# EAGLE design Cardbus Card Extender (EAGLE 6.5.0)
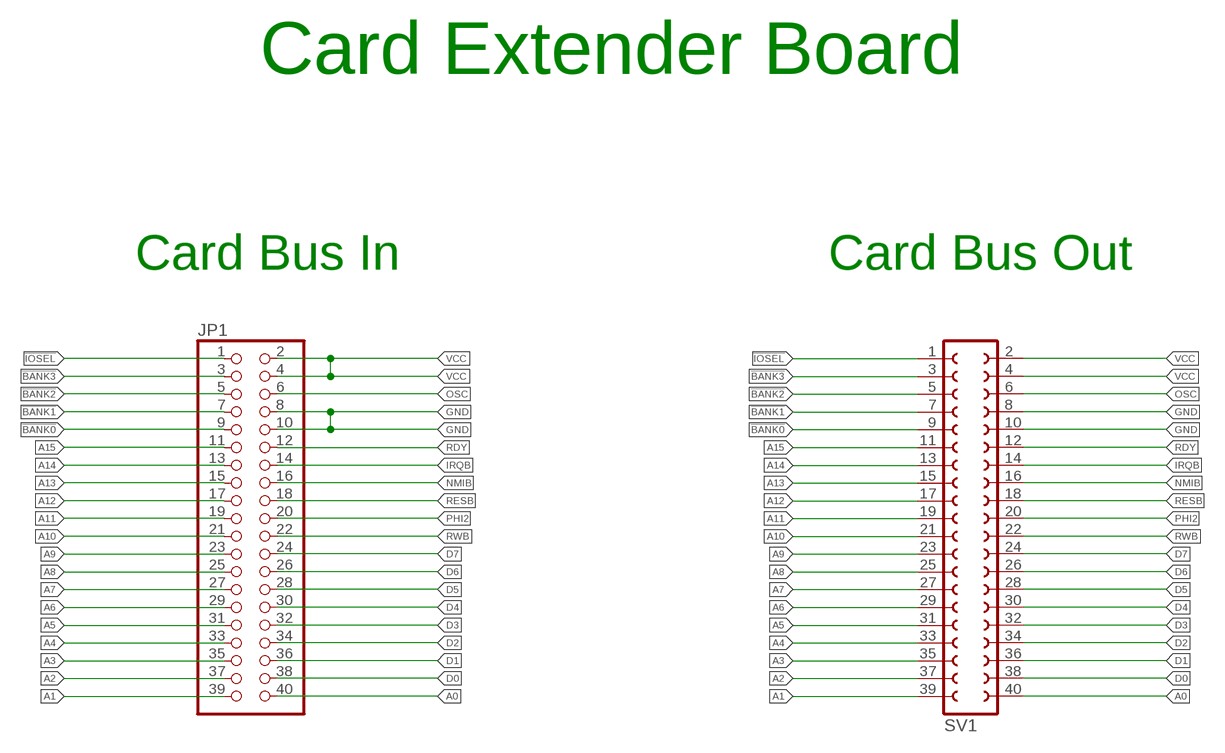
[diagram p0: schematic, sheet 1]

## Parts
JP1  PINHD-2X20/90  [2X20/90]
SV1  FE20-2W  [FE20-2W]

## Nets
!BANK0: JP1.9 SV1.9
!BANK1: JP1.7 SV1.7
!BANK2: JP1.5 SV1.5
!BANK3: JP1.3 SV1.3
!IOSEL: JP1.1 SV1.1
A0: JP1.40 SV1.40
A1: JP1.39 SV1.39
A2: JP1.37 SV1.37
A3: JP1.35 SV1.35
A4: JP1.33 SV1.33
A5: JP1.31 SV1.31
A6: JP1.29 SV1.29
A7: JP1.27 SV1.27
A8: JP1.25 SV1.25
A9: JP1.23 SV1.23
A10: JP1.21 SV1.21
A11: JP1.19 SV1.19
A12: JP1.17 SV1.17
A13: JP1.15 SV1.15
A14: JP1.13 SV1.13
A15: JP1.11 SV1.11
D0: JP1.38 SV1.38
D1: JP1.36 SV1.36
D2: JP1.34 SV1.34
D3: JP1.32 SV1.32
D4: JP1.30 SV1.30
D5: JP1.28 SV1.28
D6: JP1.26 SV1.26
D7: JP1.24 SV1.24
GND: JP1.8 JP1.10 SV1.8 SV1.10
IRQB: JP1.14 SV1.14
NMIB: JP1.16 SV1.16
OSC: JP1.6 SV1.6
PHI2: JP1.20 SV1.20
RDY: JP1.12 SV1.12
RESB: JP1.18 SV1.18
RWB: JP1.22 SV1.22
VCC: JP1.2 JP1.4 SV1.2 SV1.4

## Notes on the sheet
- Card Extender Board
- Card Bus In | Card Bus Out

## Library data of the parts
JP1 = pinhead:PINHD-2X20: PIN HEADER
SV1 = con-lsta:FE20-2W: FEMALE HEADER; OC_FARNELL: unknown; OC_NEWARK: unknown

## Board
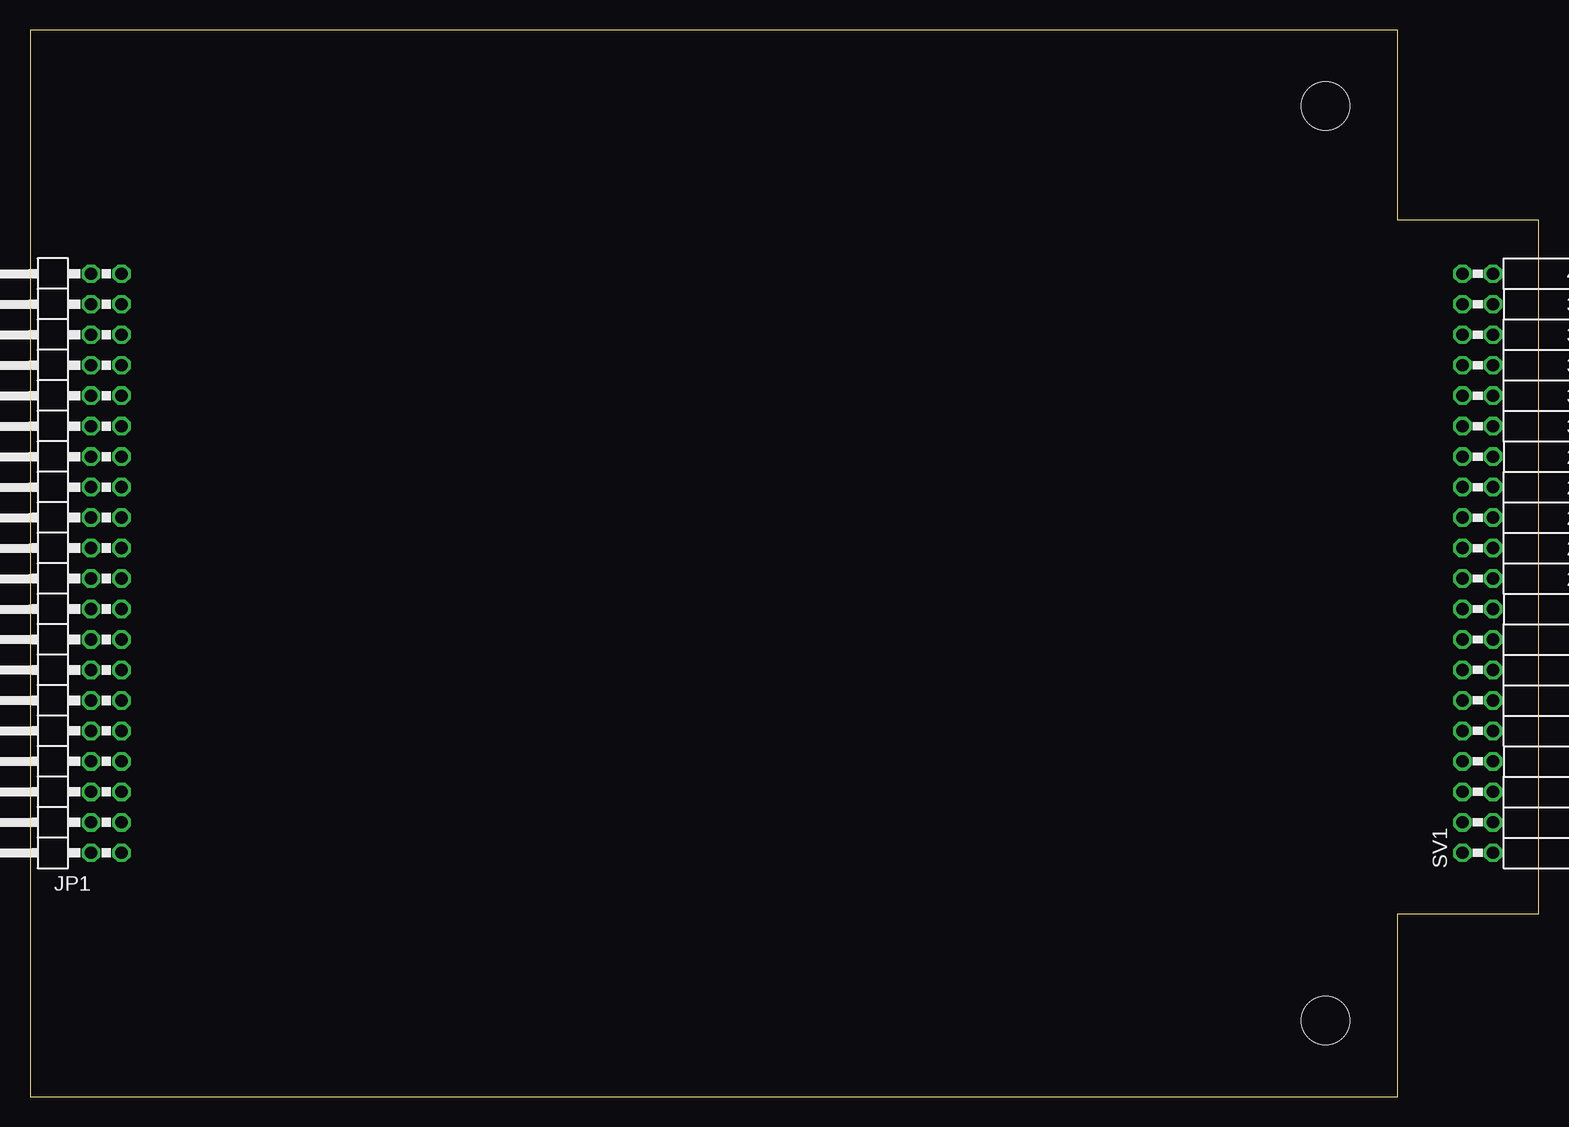
[diagram p1: board, top side]
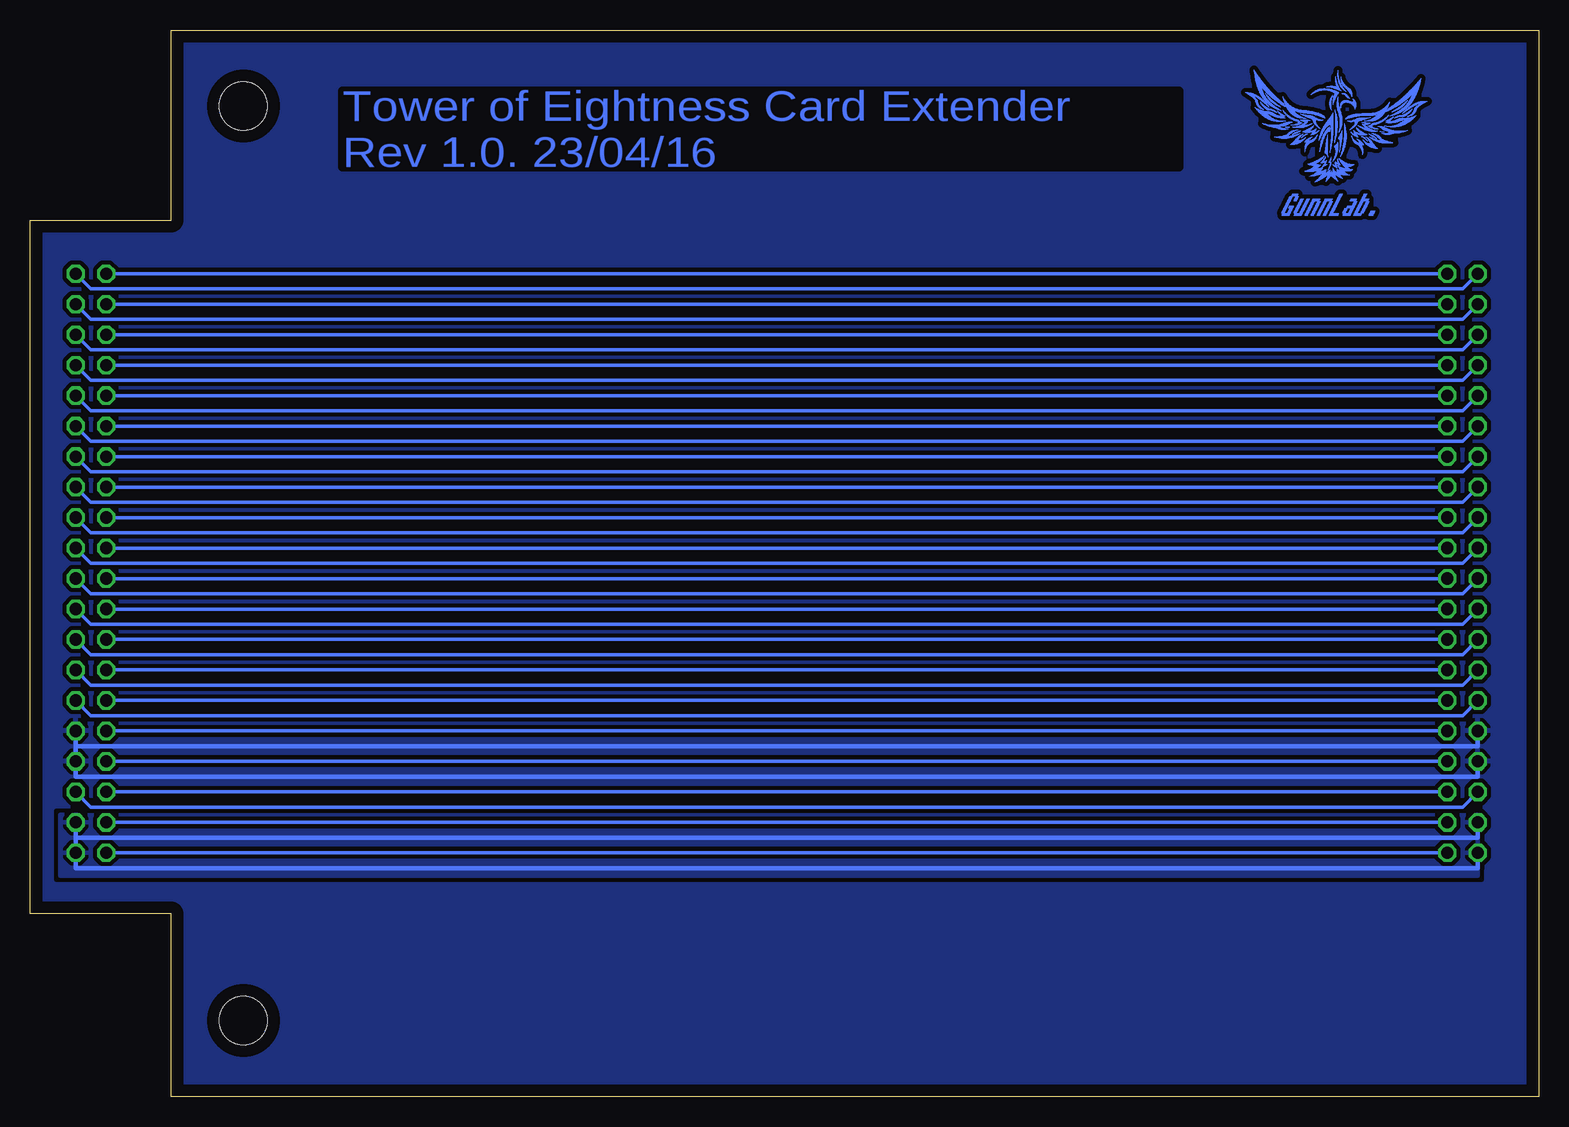
[diagram p2: board, bottom side, seen from below]

Size 125.73 x 88.89 mm. Coordinates in mm from the lower left corner, seen from the top.
Outline: 0,0 113.97,0 113.97,15.24 125.73,15.24 125.73,73.03 113.97,73.03 113.97,88.89 0,88.89 0,0
Copper layers (1*16): Top 0.035mm / dielectric 1.5mm / Bottom 0.035mm
Design rules "default *": minimum track width 10mil, minimum drill 24mil, track to track 8mil, track to pad 8mil, pad to pad 8mil, via to via 8mil, smd to smd 8mil, copper to edge 40mil, drill to drill 8mil, minimum pad ring 10mil, minimum via ring 8mil, stop-mask expansion 4mil, vias tented up to drill 0mil, thermal gap 12mil
Holes 4 mm at 107.95,82.55 107.95,6.35

### Footprints (pad centres in the part's own frame; a part is rotated, then mirrored left to right if it is on the bottom)
2X20/90 = drill 1.016 octagon: 1 -24.13,-6.35; 2 -24.13,-3.81; 3 -21.59,-6.35; 4 -21.59,-3.81; 5 -19.05,-6.35; 6 -19.05,-3.81; 7 -16.51,-6.35; 8 -16.51,-3.81; 9 -13.97,-6.35; 10 -13.97,-3.81; 11 -11.43,-6.35; 12 -11.43,-3.81; 13 -8.89,-6.35; 14 -8.89,-3.81; 15 -6.35,-6.35; 16 -6.35,-3.81; 17 -3.81,-6.35; 18 -3.81,-3.81; 19 -1.27,-6.35; 20 -1.27,-3.81; 21 1.27,-6.35; 22 1.27,-3.81; 23 3.81,-6.35; 24 3.81,-3.81; 25 6.35,-6.35; 26 6.35,-3.81; 27 8.89,-6.35; 28 8.89,-3.81; 29 11.43,-6.35; 30 11.43,-3.81; 31 13.97,-6.35; 32 13.97,-3.81; 33 16.51,-6.35; 34 16.51,-3.81; 35 19.05,-6.35; 36 19.05,-3.81; 37 21.59,-6.35; 38 21.59,-3.81; 39 24.13,-6.35; 40 24.13,-3.81
FE20-2W = drill 1.016 octagon: 1 -24.13,1.27; 2 -24.13,-1.27; 3 -21.59,1.27; 4 -21.59,-1.27; 5 -19.05,1.27; 6 -19.05,-1.27; 7 -16.51,1.27; 8 -16.51,-1.27; 9 -13.97,1.27; 10 -13.97,-1.27; 11 -11.43,1.27; 12 -11.43,-1.27; 13 -8.89,1.27; 14 -8.89,-1.27; 15 -6.35,1.27; 16 -6.35,-1.27; 17 -3.81,1.27; 18 -3.81,-1.27; 19 -1.27,1.27; 20 -1.27,-1.27; 21 1.27,1.27; 22 1.27,-1.27; 23 3.81,1.27; 24 3.81,-1.27; 25 6.35,1.27; 26 6.35,-1.27; 27 8.89,1.27; 28 8.89,-1.27; 29 11.43,1.27; 30 11.43,-1.27; 31 13.97,1.27; 32 13.97,-1.27; 33 16.51,1.27; 34 16.51,-1.27; 35 19.05,1.27; 36 19.05,-1.27; 37 21.59,1.27; 38 21.59,-1.27; 39 24.13,1.27; 40 24.13,-1.27

### Placement (x,y rotation side)
JP1  1.27,44.45 90 top
SV1  120.65,44.45 90 top
U$1  [LIONTECH]  17.14,80.01 0 top

### Tracks (layer width: path | path; a pad name or v marks a point on that pad's centre or on a via)
!BANK0
  Bottom 0.305: SV1.9 JP1.9
!BANK1
  Bottom 0.305: JP1.7 SV1.7
!BANK2
  Bottom 0.305: SV1.5 JP1.5
!BANK3
  Bottom 0.305: SV1.3 JP1.3
!IOSEL
  Bottom 0.305: JP1.1 SV1.1
A0
  Bottom 0.305: JP1.40 6.35,67.31 120.65,67.31 SV1.40
A1
  Bottom 0.305: JP1.39 SV1.39
A2
  Bottom 0.305: JP1.37 SV1.37
A3
  Bottom 0.305: JP1.35 SV1.35
A4
  Bottom 0.305: JP1.33 SV1.33
A5
  Bottom 0.305: JP1.31 SV1.31
A6
  Bottom 0.305: JP1.29 SV1.29
A7
  Bottom 0.305: JP1.27 SV1.27
A8
  Bottom 0.305: JP1.25 SV1.25
A9
  Bottom 0.305: SV1.23 JP1.23
A10
  Bottom 0.305: SV1.21 JP1.21
A11
  Bottom 0.305: SV1.19 JP1.19
A12
  Bottom 0.305: SV1.17 JP1.17
A13
  Bottom 0.305: SV1.15 JP1.15
A14
  Bottom 0.305: SV1.13 JP1.13
A15
  Bottom 0.305: SV1.11 JP1.11
D0
  Bottom 0.305: JP1.38 6.35,64.77 120.65,64.77 SV1.38
D1
  Bottom 0.305: JP1.36 6.35,62.23 120.65,62.23 SV1.36
D2
  Bottom 0.305: JP1.34 6.35,59.69 120.65,59.69 SV1.34
D3
  Bottom 0.305: JP1.32 6.35,57.15 120.65,57.15 SV1.32
D4
  Bottom 0.305: JP1.30 6.35,54.61 120.65,54.61 SV1.30
D5
  Bottom 0.305: JP1.28 6.35,52.07 120.65,52.07 SV1.28
D6
  Bottom 0.305: JP1.26 6.35,49.53 120.65,49.53 SV1.26
D7
  Bottom 0.305: JP1.24 6.35,46.99 120.65,46.99 SV1.24
GND
  Bottom 0.356: JP1.10 5.08,29.21 121.92,29.21 | 121.92,29.21 SV1.10 | JP1.8 5.08,26.67 121.92,26.67 SV1.8 121.92,29.21
  pour Bottom (isolate 0.356, rank 2): 0,88.9 114.3,88.9 114.3,73.03 125.73,73.03 125.73,15.24 114.3,15.24 114.3,0 0,0
IRQB
  Bottom 0.305: JP1.14 6.35,34.29 120.65,34.29 SV1.14
NMIB
  Bottom 0.305: JP1.16 6.35,36.83 120.65,36.83 SV1.16
OSC
  Bottom 0.305: JP1.6 6.35,24.13 120.65,24.13 SV1.6
PHI2
  Bottom 0.305: JP1.20 6.35,41.91 120.65,41.91 SV1.20
RDY
  Bottom 0.305: JP1.12 6.35,31.75 120.65,31.75 SV1.12
RESB
  Bottom 0.305: JP1.18 6.35,39.37 120.65,39.37 SV1.18
RWB
  Bottom 0.305: JP1.22 6.35,44.45 120.65,44.45 SV1.22
VCC
  Bottom 0.356: JP1.4 5.08,21.59 121.92,21.59 | 121.92,21.59 SV1.4 | JP1.2 5.08,19.05 121.92,19.05 SV1.2 121.92,21.59
  pour Bottom (isolate 0.356): 123.19,23.5 5.08,23.5 5.08,18.41 123.19,18.41

### Text on the board
Bottom: Tower of Eightness Card Extender / Rev 1.0. 23/04/16